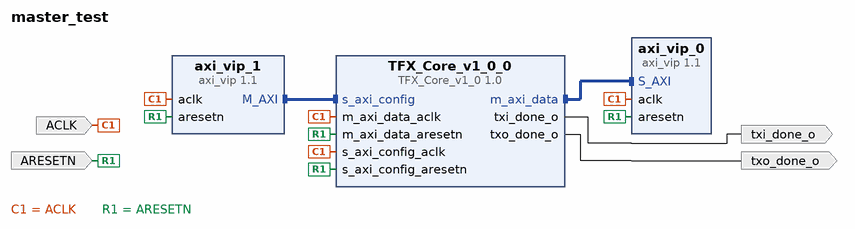
[diagram p0: block diagram of the top level]
# Vivado block design master_test, xc7z010clg400-1, Vivado 2021.1
create_bd_design master_test

create_bd_port -dir I -type clk ACLK
create_bd_port -dir I -type rst ARESETN
create_bd_port -dir O -type intr txo_done_o
create_bd_port -dir O txi_done_o

create_bd_cell -type ip -vlnv xilinx.com:ip:axi_vip:1.1 axi_vip_0
set_property -dict {CONFIG.INTERFACE_MODE SLAVE} [get_bd_cells axi_vip_0]
create_bd_cell -type ip -vlnv xilinx.com:ip:axi_vip:1.1 axi_vip_1
set_property -dict [list \
  CONFIG.ADDR_WIDTH 32 \
  CONFIG.DATA_WIDTH 32 \
  CONFIG.HAS_BRESP 1 \
  CONFIG.HAS_PROT 1 \
  CONFIG.HAS_RRESP 1 \
  CONFIG.HAS_WSTRB 1 \
  CONFIG.INTERFACE_MODE MASTER \
  CONFIG.PROTOCOL AXI4LITE \
  CONFIG.READ_WRITE_MODE READ_WRITE \
] [get_bd_cells axi_vip_1]
create_bd_cell -type ip -vlnv user.org:user:TFX_Core_v1_0:1.0 TFX_Core_v1_0_0
set_property -dict [list \
  CONFIG.C_M_AXI_Data_BURST_LEN 256 \
  CONFIG.C_M_AXI_Data_TARGET_SLAVE_BASE_ADDR 0x10000000 \
] [get_bd_cells TFX_Core_v1_0_0]

# ---- connections ----

connect_bd_intf_net [get_bd_intf_pins TFX_Core_v1_0_0/m_axi_data] [get_bd_intf_pins axi_vip_0/S_AXI]
connect_bd_intf_net [get_bd_intf_pins axi_vip_1/M_AXI] [get_bd_intf_pins TFX_Core_v1_0_0/s_axi_config]
connect_bd_net -net TFX_Core_v1_0_0_cwt_done [get_bd_pins TFX_Core_v1_0_0/txo_done_o] [get_bd_ports txo_done_o]
connect_bd_net [get_bd_pins TFX_Core_v1_0_0/txi_done_o] [get_bd_ports txi_done_o]
connect_bd_net -net m_axi_data_aclk_0_1 [get_bd_ports ACLK] \
  [get_bd_pins axi_vip_0/aclk] [get_bd_pins axi_vip_1/aclk] [get_bd_pins TFX_Core_v1_0_0/s_axi_config_aclk] \
  [get_bd_pins TFX_Core_v1_0_0/m_axi_data_aclk]
connect_bd_net -net s_axi_config_aresetn_0_1 [get_bd_ports ARESETN] \
  [get_bd_pins axi_vip_0/aresetn] [get_bd_pins axi_vip_1/aresetn] [get_bd_pins TFX_Core_v1_0_0/s_axi_config_aresetn] \
  [get_bd_pins TFX_Core_v1_0_0/m_axi_data_aresetn]

# ---- address map ----
assign_bd_address -offset 0x00000000 -range 64K -target_address_space [get_bd_addr_spaces axi_vip_1/Master_AXI] [get_bd_addr_segs TFX_Core_v1_0_0/s_axi_config/reg0]
assign_bd_address -offset 0x50000000 -range 64K -target_address_space [get_bd_addr_spaces TFX_Core_v1_0_0/m_axi_data] [get_bd_addr_segs axi_vip_0/S_AXI/Reg]

validate_bd_design
save_bd_design
